# Altium schematic sheet PMU.SchDoc: main_assy PCB
size A4
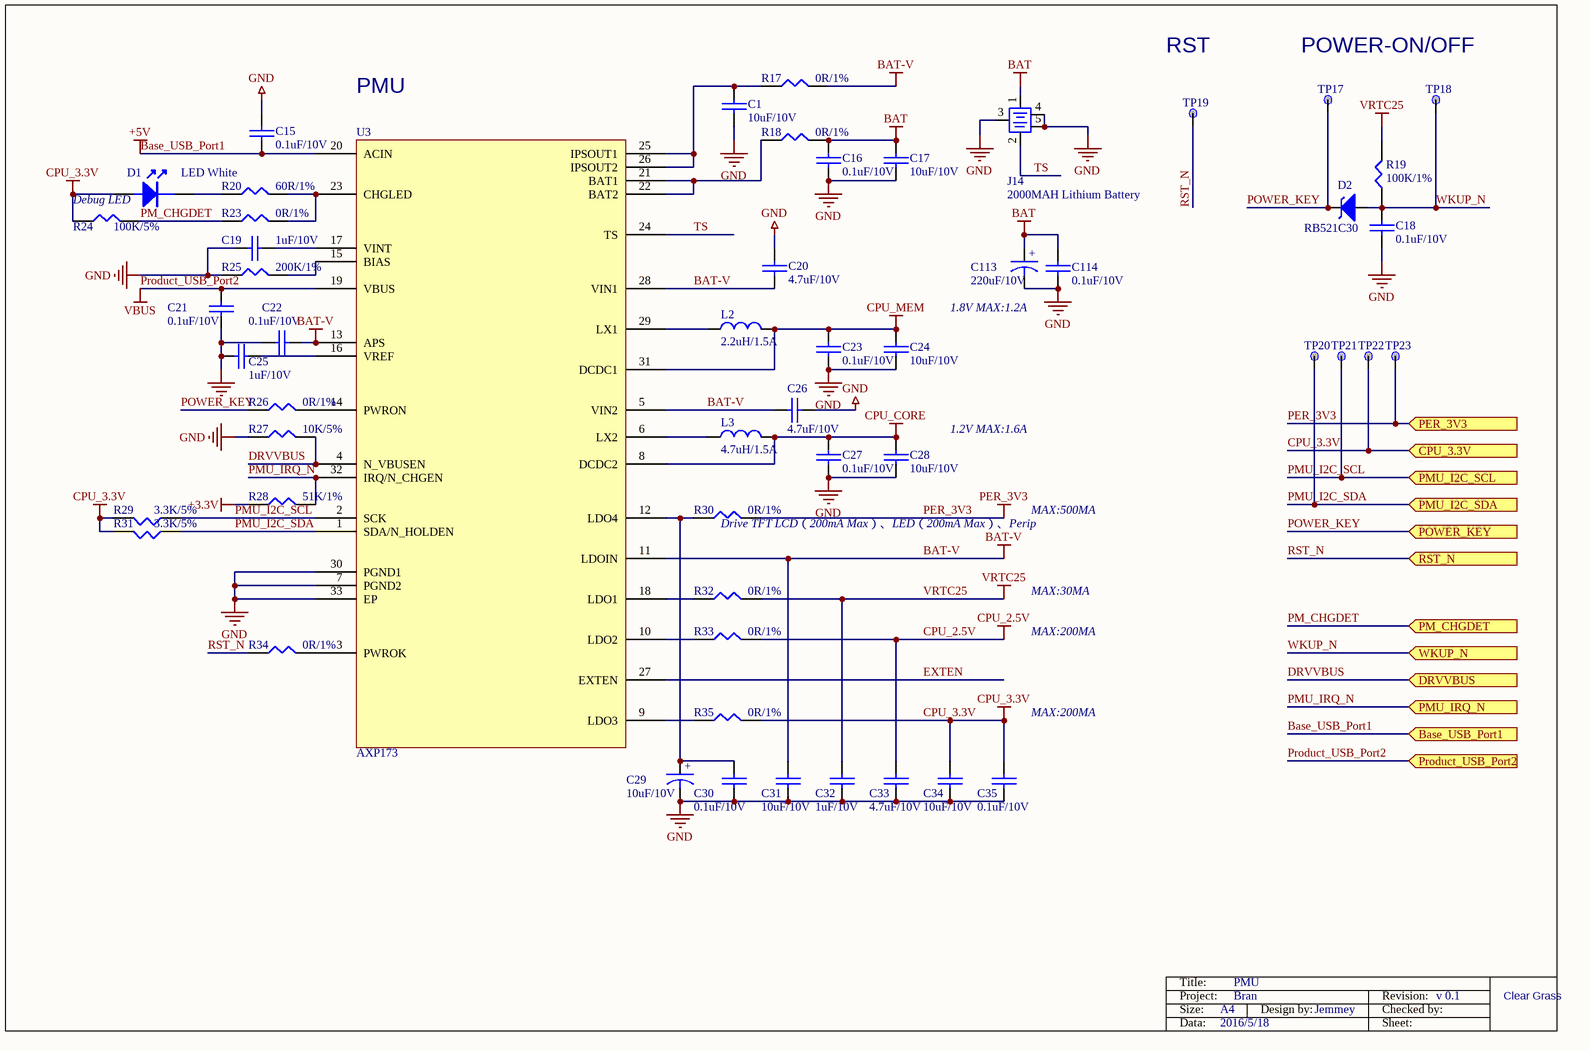
[diagram p0: PMU.SchDoc]

## Parts
C1  10uF/10V  [0402C]
C15  0.1uF/10V  [0402C]
C16  0.1uF/10V  [0402C]
C17  10uF/10V  [0402C]
C18  0.1uF/10V  [0402C]
C19  1uF/10V  [0402C]
C20  4.7uF/10V  [0402C]
C21  0.1uF/10V  [0402C]
C22  0.1uF/10V  [0402C]
C23  0.1uF/10V  [0402C]
C24  10uF/10V  [0402C]
C25  1uF/10V  [0402C]
C26  4.7uF/10V  [0402C]
C27  0.1uF/10V  [0402C]
C28  10uF/10V  [0402C]
C29  10uF/10V  [6032]
C30  0.1uF/10V  [0402C]
C31  10uF/10V  [0402C]
C32  1uF/10V  [0402C]
C33  4.7uF/10V  [0402C]
C34  10uF/10V  [0402C]
C35  0.1uF/10V  [0402C]
C113  220uF/10V  [6032]
C114  0.1uF/10V  [0402C]
D1  LED White  [0402LED]
D2  RB521C30  [DO-214AC]
J14  2000MAH Lithium Battery  [Molex-1-3A]
L2  2.2uH/1.5A  [Inductance]
L3  4.7uH/1.5A  [Inductance]
R17  0R/1%  [0402R]
R18  0R/1%  [0402R]
R19  100K/1%  [0402R]
R20  60R/1%  [0402R]
R23  0R/1%  [0402R]
R24  100K/5%  [0402R]
R25  200K/1%  [0402R]
R26  0R/1%  [0402R]
R27  10K/5%  [0402R]
R28  51K/1%  [0402R]
R29  3.3K/5%  [0402R]
R30  0R/1%  [0402R]
R31  3.3K/5%  [0402R]
R32  0R/1%  [0402R]
R33  0R/1%  [0402R]
R34  0R/1%  [0402R]
R35  0R/1%  [0402R]
TP17  TP  [TP_C40]  (value not drawn)
TP18  TP  [TP_C40]  (value not drawn)
TP19  TP  [TP_C40]  (value not drawn)
TP20  TP  [TP_C40]  (value not drawn)
TP21  TP  [TP_C40]  (value not drawn)
TP22  TP  [TP_C40]  (value not drawn)
TP23  TP  [TP_C40]  (value not drawn)
U3  AXP173

## Ports
Base_USB_Port1 (in), CPU_3.3V (in), DRVVBUS (in), PER_3V3 (in), PM_CHGDET (in), PMU_I2C_SCL (in), PMU_I2C_SDA (in), PMU_IRQ_N (in), POWER_KEY (in), Product_USB_Port2 (in), RST_N (in), WKUP_N (in)

## Nets
+3.3V: R28.1
Base_USB_Port1: C15.1 U3.20(ACIN) ; port Base_USB_Port1  [also labelled +5V]
BAT: C16.2 C17.2 C113.1 C114.2 J14.1(VCC) R18.2
BAT-V: C20.2 C22.1 C26.2 C31.1 R17.2 U3.5(VIN2) U3.11(LDOIN) U3.13(APS) U3.28(VIN1)
CPU_2.5V: C33.1 R33.2
CPU_3.3V: C34.1 C35.1 D1.2 R24.1 R29.2 R31.2 R35.2 TP22.1 ; port CPU_3.3V
CPU_CORE: C27.2 C28.2 L3.2 U3.8(DCDC2)
CPU_MEM: C23.2 C24.2 L2.2 U3.31(DCDC1)
GND: C1.1 C15.2 C16.1 C17.1 C18.1 C19.2 C20.1 C21.1 C22.2 C23.1 C24.1 C25.2 C26.1 C27.1 C28.1 C29.2 C30.1 C31.2 C32.2 C33.2 C34.2 C35.2 C113.2 C114.1 J14.3(GND) J14.4(PAD) J14.5(PAD) R25.1 R27.1 U3.7(PGND2) U3.30(PGND1) U3.33(EP)
PER_3V3: R30.2 TP23.1 ; port PER_3V3
Product_USB_Port2: C21.2 U3.19(VBUS) ; port Product_USB_Port2  [also labelled VBUS]
VRTC25: C32.1 R19.2 R32.2
DRVVBUS: R27.2 U3.4(N_VBUSEN) ; port DRVVBUS
EXTEN: U3.27(EXTEN)
PM_CHGDET: R23.1 R24.2 ; port PM_CHGDET
PMU_I2C_SCL: R29.1 TP21.1 U3.2(SCK) ; port PMU_I2C_SCL
PMU_I2C_SDA: R31.1 TP20.1 U3.1(SDA/N_HOLDEN) ; port PMU_I2C_SDA
PMU_IRQ_N: R28.2 U3.32(IRQ/N_CHGEN) ; port PMU_IRQ_N
POWER_KEY: D2.1(K) R26.1 TP17.1 ; port POWER_KEY
RST_N: R34.1 TP19.1 ; port RST_N
TS: J14.2(NTC) U3.24(TS)
WKUP_N: C18.2 D2.2(A) R19.1 TP18.1 ; port WKUP_N
NetC1_2: C1.2 R17.1 U3.25(IPSOUT1) U3.26(IPSOUT2)
NetC19_1: C19.1 U3.17(VINT)
NetC25_1: C25.1 U3.16(VREF)
NetC29_1: C29.1 C30.2 R30.1 U3.12(LDO4)
NetD1_1: D1.1 R20.1
NetL2_1: L2.1 U3.29(LX1)
NetL3_1: L3.1 U3.6(LX2)
NetR18_1: R18.1 U3.21(BAT1) U3.22(BAT2)
NetR20_2: R20.2 R23.2 U3.23(CHGLED)
NetR25_2: R25.2 U3.15(BIAS)
NetR26_2: R26.2 U3.14(PWRON)
NetR32_1: R32.1 U3.18(LDO1)
NetR33_1: R33.1 U3.10(LDO2)
NetR34_2: R34.2 U3.3(PWROK)
NetR35_1: R35.1 U3.9(LDO3)

## Notes on the sheet
- PMU
- RST
- POWER-ON/OFF
- (near D1) Debug LED
- 1.8V MAX:1.2A
- 1.2V MAX:1.6A
- MAX:500MA
- (near R30) Drive TFT LCD（200mA Max）、LED（200mA Max）、Perip
- MAX:30MA
- MAX:200MA
- Title:
- Project:
- Size:
- Data:
- A4
- 2016/5/18
- Bran
- Design by:
- Jemmey
- Revision:
- Sheet:
- Checked by:
- v 0.1
- Clear Grass
- (in symbol Capacitor) +

## Library data of the parts
C1 C15-C28 C30-C35 C114 = CAP: 厂家：Murata，型号：GRM155R71A104KA01D
C29 C113 = Capacitor
D1 = LED: 厂家：ROHM，型号：SCMP13WBC8W1**
D2 = Sc: 厂家：ROHM，型号：RB480Y-90
J14 = BL-5C
L2 L3 = CHOKE
R17-R20 R23-R35 = RES1: 厂家：Yageo，型号：RC0402FR-0710KL
TP17-TP23 = TP: Ordered by: Subcon